# Altium schematic sheet 00Key.SchDoc
size 419 x 297 mm
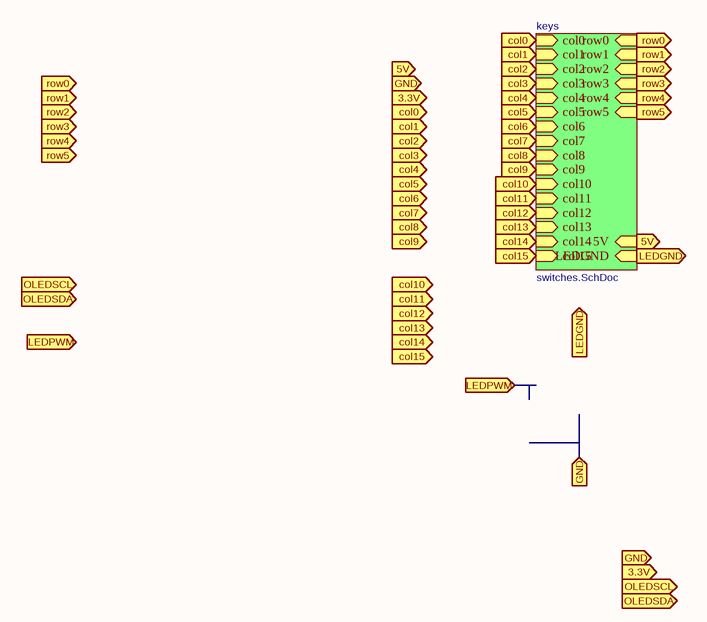
[diagram p0: 00Key.SchDoc]

## Sub-sheets
keys = switches.SchDoc: col0 (in), col1 (in), col2 (in), col3 (in), col4 (in), col5 (in), col6 (in), col7 (in), col8 (in), col9 (in), col10 (in), col11 (in), col12 (in), col13 (in), col14 (in), col15 (in), row0 (in), row1 (in), row2 (in), row3 (in), row4 (in), row5 (in), LEDGND (in), 5V (in)

## Ports
3.3V (in), 5V (in), col0 (in), col1 (in), col2 (in), col3 (in), col4 (in), col5 (in), col6 (in), col7 (in), col8 (in), col9 (in), col10 (in), col11 (in), col12 (in), col13 (in), col14 (in), col15 (in), GND (in), LEDGND (in), LEDPWM (in), OLEDSCL (in), OLEDSDA (in), row0 (in), row1 (in), row2 (in), row3 (in), row4 (in), row5 (in)

## Nets
5V: port 5V, sheet keys/5V
col0: port col0, sheet keys/col0
col1: port col1, sheet keys/col1
col2: port col2, sheet keys/col2
col3: port col3, sheet keys/col3
col4: port col4, sheet keys/col4
col5: port col5, sheet keys/col5
col6: port col6, sheet keys/col6
col7: port col7, sheet keys/col7
col8: port col8, sheet keys/col8
col9: port col9, sheet keys/col9
col10: port col10, sheet keys/col10
col11: port col11, sheet keys/col11
col12: port col12, sheet keys/col12
col13: port col13, sheet keys/col13
col14: port col14, sheet keys/col14
col15: port col15, sheet keys/col15
LEDGND: port LEDGND, sheet keys/LEDGND
row0: port row0, sheet keys/row0
row1: port row1, sheet keys/row1
row2: port row2, sheet keys/row2
row3: port row3, sheet keys/row3
row4: port row4, sheet keys/row4
row5: port row5, sheet keys/row5

## Notes on the sheet
- 1
- 2
- 3
- 4
- 5
- 6
- 7
- 8
- A
- B
- C
- D
- E
- Title:
- File: 00Key.sch
- Sheet: /
- F
- KiCad E.D.A.  kicad (5.1.4)-1
- Size: A4
- Date:
- Rev:
- Id: 1/2